# Altium schematic sheet S7CAS-PLEIADES-CARTE-MERE_P07_FPGA_3.SchDoc
size Tabloid; DocumentNumber: 7; SheetNumber: 7; SheetTotal: 16; Sheet_Name: FPGA_3; Size: 11x17
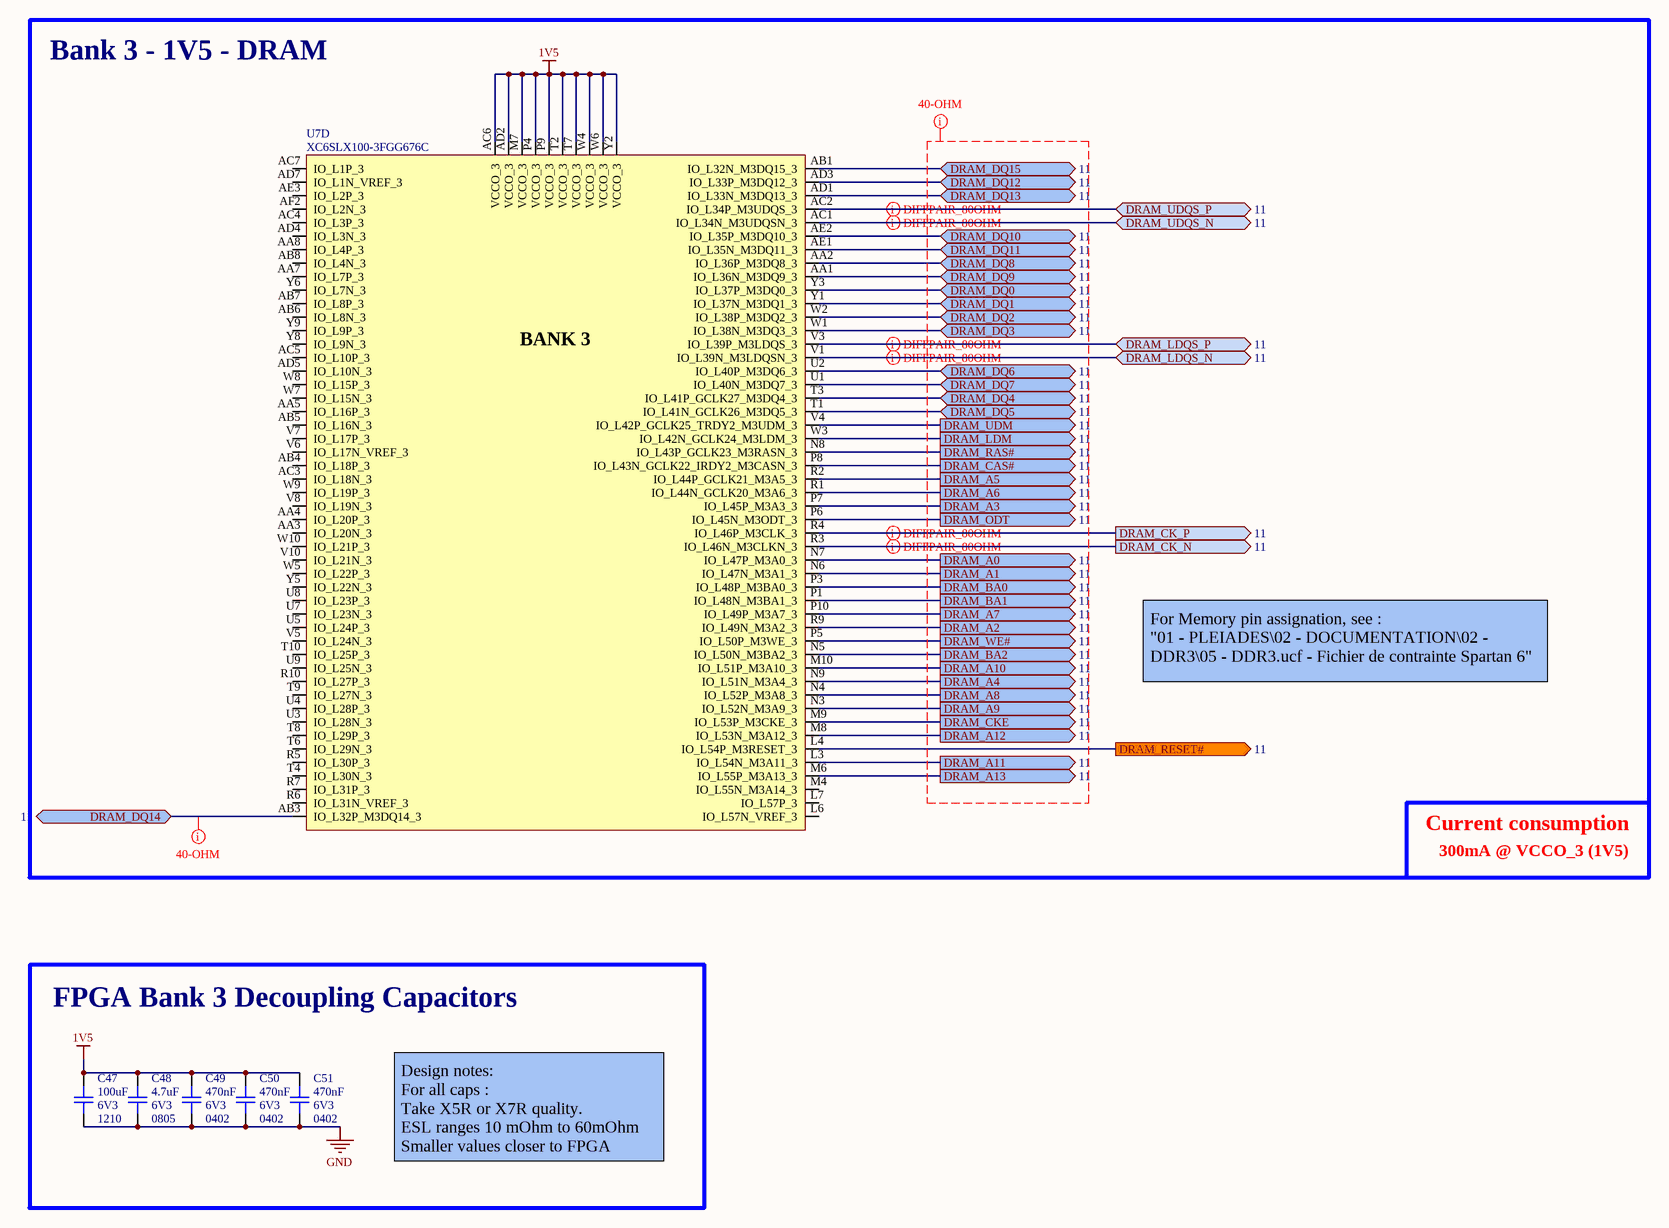
[diagram p0: S7CAS-PLEIADES-CARTE-MERE_P07_FPGA_3.SchDoc]

## Parts
C47  value 100uF  Voltage: 6V3  Package: 1210  [CAP_1210]  (hidden comment: CAP - 1210)
C48  value 4.7uF  Voltage: 6V3  Package: 0805  [CAP_0805]  (hidden comment: CAP - 0805)
C49  value 470nF  Voltage: 6V3  Package: 0402  [CAP_0402]  (hidden comment: CAP - 0402)
C50  value 470nF  Voltage: 6V3  Package: 0402  [CAP_0402]  (hidden comment: CAP - 0402)
C51  value 470nF  Voltage: 6V3  Package: 0402  [CAP_0402]  (hidden comment: CAP - 0402)
U7  XC6SLX100-3FGG676C  [FPGA_XILINX_FGG676]  (part D of 10)

## Blocks framed on the sheet
Bank 3 - 1V5 - DRAM: U7
FPGA Bank 3 Decoupling Capacitors: C47-C51

## Ports
DRAM_A0 (out, see 11), DRAM_A1 (out, see 11), DRAM_A2 (out, see 11), DRAM_A3 (out, see 11), DRAM_A4 (out, see 11), DRAM_A5 (out, see 11), DRAM_A6 (out, see 11), DRAM_A7 (out, see 11), DRAM_A8 (out, see 11), DRAM_A9 (out, see 11), DRAM_A10 (out, see 11), DRAM_A11 (out, see 11), DRAM_A12 (out, see 11), DRAM_A13 (out, see 11), DRAM_BA0 (out, see 11), DRAM_BA1 (out, see 11), DRAM_BA2 (out, see 11), DRAM_CAS# (out, see 11), DRAM_CK_N (out, see 11), DRAM_CK_P (out, see 11), DRAM_CKE (out, see 11), DRAM_DQ0 (bidir, see 11), DRAM_DQ1 (bidir, see 11), DRAM_DQ2 (bidir, see 11), DRAM_DQ3 (bidir, see 11), DRAM_DQ4 (bidir, see 11), DRAM_DQ5 (bidir, see 11), DRAM_DQ6 (bidir, see 11), DRAM_DQ7 (bidir, see 11), DRAM_DQ8 (bidir, see 11), DRAM_DQ9 (bidir, see 11), DRAM_DQ10 (bidir, see 11), DRAM_DQ11 (bidir, see 11), DRAM_DQ12 (bidir, see 11), DRAM_DQ13 (bidir, see 11), DRAM_DQ14 (bidir, see 11), DRAM_DQ15 (bidir, see 11), DRAM_LDM (out, see 11), DRAM_LDQS_N (bidir, see 11), DRAM_LDQS_P (bidir, see 11), DRAM_ODT (out, see 11), DRAM_RAS# (out, see 11), DRAM_RESET# (out, see 11), DRAM_UDM (out, see 11), DRAM_UDQS_N (bidir, see 11), DRAM_UDQS_P (bidir, see 11), DRAM_WE# (out, see 11)

## Nets
1V5: C47.2 C48.2 C49.2 C50.2 C51.2 U7.AC6(VCCO_3) U7.AD2(VCCO_3) U7.M7(VCCO_3) U7.P4(VCCO_3) U7.P9(VCCO_3) U7.T2(VCCO_3) U7.T7(VCCO_3) U7.W4(VCCO_3) U7.W6(VCCO_3) U7.Y2(VCCO_3)
GND: C47.1 C48.1 C49.1 C50.1 C51.1
DRAM_A0: U7.N7(IO_L47P_M3A0_3) ; port DRAM_A0
DRAM_A1: U7.N6(IO_L47N_M3A1_3) ; port DRAM_A1
DRAM_A2: U7.R9(IO_L49N_M3A2_3) ; port DRAM_A2
DRAM_A3: U7.P7(IO_L45P_M3A3_3) ; port DRAM_A3
DRAM_A4: U7.N9(IO_L51N_M3A4_3) ; port DRAM_A4
DRAM_A5: U7.R2(IO_L44P_GCLK21_M3A5_3) ; port DRAM_A5
DRAM_A6: U7.R1(IO_L44N_GCLK20_M3A6_3) ; port DRAM_A6
DRAM_A7: U7.P10(IO_L49P_M3A7_3) ; port DRAM_A7
DRAM_A8: U7.N4(IO_L52P_M3A8_3) ; port DRAM_A8
DRAM_A9: U7.N3(IO_L52N_M3A9_3) ; port DRAM_A9
DRAM_A10: U7.M10(IO_L51P_M3A10_3) ; port DRAM_A10
DRAM_A11: U7.L3(IO_L54N_M3A11_3) ; port DRAM_A11
DRAM_A12: U7.M8(IO_L53N_M3A12_3) ; port DRAM_A12
DRAM_A13: U7.M6(IO_L55P_M3A13_3) ; port DRAM_A13
DRAM_BA0: U7.P3(IO_L48P_M3BA0_3) ; port DRAM_BA0
DRAM_BA1: U7.P1(IO_L48N_M3BA1_3) ; port DRAM_BA1
DRAM_BA2: U7.N5(IO_L50N_M3BA2_3) ; port DRAM_BA2
DRAM_CAS#: U7.P8(IO_L43N_GCLK22_IRDY2_M3CASN_3) ; port DRAM_CAS#
DRAM_CK_N: U7.R3(IO_L46N_M3CLKN_3) ; port DRAM_CK_N
DRAM_CK_P: U7.R4(IO_L46P_M3CLK_3) ; port DRAM_CK_P
DRAM_CKE: U7.M9(IO_L53P_M3CKE_3) ; port DRAM_CKE
DRAM_DQ0: U7.Y3(IO_L37P_M3DQ0_3) ; port DRAM_DQ0
DRAM_DQ1: U7.Y1(IO_L37N_M3DQ1_3) ; port DRAM_DQ1
DRAM_DQ2: U7.W2(IO_L38P_M3DQ2_3) ; port DRAM_DQ2
DRAM_DQ3: U7.W1(IO_L38N_M3DQ3_3) ; port DRAM_DQ3
DRAM_DQ4: U7.T3(IO_L41P_GCLK27_M3DQ4_3) ; port DRAM_DQ4
DRAM_DQ5: U7.T1(IO_L41N_GCLK26_M3DQ5_3) ; port DRAM_DQ5
DRAM_DQ6: U7.U2(IO_L40P_M3DQ6_3) ; port DRAM_DQ6
DRAM_DQ7: U7.U1(IO_L40N_M3DQ7_3) ; port DRAM_DQ7
DRAM_DQ8: U7.AA2(IO_L36P_M3DQ8_3) ; port DRAM_DQ8
DRAM_DQ9: U7.AA1(IO_L36N_M3DQ9_3) ; port DRAM_DQ9
DRAM_DQ10: U7.AE2(IO_L35P_M3DQ10_3) ; port DRAM_DQ10
DRAM_DQ11: U7.AE1(IO_L35N_M3DQ11_3) ; port DRAM_DQ11
DRAM_DQ12: U7.AD3(IO_L33P_M3DQ12_3) ; port DRAM_DQ12
DRAM_DQ13: U7.AD1(IO_L33N_M3DQ13_3) ; port DRAM_DQ13
DRAM_DQ14: U7.AB3(IO_L32P_M3DQ14_3) ; port DRAM_DQ14
DRAM_DQ15: U7.AB1(IO_L32N_M3DQ15_3) ; port DRAM_DQ15
DRAM_LDM: U7.W3(IO_L42N_GCLK24_M3LDM_3) ; port DRAM_LDM
DRAM_LDQS_N: U7.V1(IO_L39N_M3LDQSN_3) ; port DRAM_LDQS_N
DRAM_LDQS_P: U7.V3(IO_L39P_M3LDQS_3) ; port DRAM_LDQS_P
DRAM_ODT: U7.P6(IO_L45N_M3ODT_3) ; port DRAM_ODT
DRAM_RAS#: U7.N8(IO_L43P_GCLK23_M3RASN_3) ; port DRAM_RAS#
DRAM_RESET#: U7.L4(IO_L54P_M3RESET_3) ; port DRAM_RESET#
DRAM_UDM: U7.V4(IO_L42P_GCLK25_TRDY2_M3UDM_3) ; port DRAM_UDM
DRAM_UDQS_N: U7.AC1(IO_L34N_M3UDQSN_3) ; port DRAM_UDQS_N
DRAM_UDQS_P: U7.AC2(IO_L34P_M3UDQS_3) ; port DRAM_UDQS_P
DRAM_WE#: U7.P5(IO_L50P_M3WE_3) ; port DRAM_WE#

Not connected (* = marked no-connect by the designer): U7 AA3(IO_L20N_3) AA4(IO_L20P_3) AA5(IO_L16P_3) AA7(IO_L7P_3) AA8(IO_L4P_3) AB4(IO_L18P_3) AB5(IO_L16N_3) AB6(IO_L8N_3) AB7(IO_L8P_3) AB8(IO_L4N_3) AC3(IO_L18N_3) AC4(IO_L3P_3) AC5(IO_L10P_3) AC7(IO_L1P_3) AD4(IO_L3N_3) AD5(IO_L10N_3) AD7(IO_L1N_VREF_3) AE3(IO_L2P_3) AF2(IO_L2N_3) L6(IO_L57N_VREF_3) L7(IO_L57P_3) M4(IO_L55N_M3A14_3) R5(IO_L30P_3) R6(IO_L31N_VREF_3) R7(IO_L31P_3) R10(IO_L27P_3) T4(IO_L30N_3) T6(IO_L29N_3) T8(IO_L29P_3) T9(IO_L27N_3) T10(IO_L25P_3) U3(IO_L28N_3) U4(IO_L28P_3) U5(IO_L24P_3) U7(IO_L23N_3) U8(IO_L23P_3) U9(IO_L25N_3) V5(IO_L24N_3) V6(IO_L17N_VREF_3) V7(IO_L17P_3) V8(IO_L19N_3) V10(IO_L21N_3) W5(IO_L22P_3) W7(IO_L15N_3) W8(IO_L15P_3) W9(IO_L19P_3) W10(IO_L21P_3) Y5(IO_L22N_3) Y6(IO_L7N_3) Y8(IO_L9N_3) Y9(IO_L9P_3)

## Layout directives
differential pair; differential pair class DIFF_80_OHM: DRAM_CK_N, DRAM_CK_P, DRAM_LDQS_N, DRAM_LDQS_P, DRAM_UDQS_N, DRAM_UDQS_P
net class SE_40OHM: (no net found under the mark), DRAM_DQ14

## Notes on the sheet
- For Memory pin assignation, see :
  "01 - PLEIADES\02 - DOCUMENTATION\02 - DDR3\05 - DDR3.ucf - Fichier de contrainte Spartan 6"
- Current consumption
- 300mA @ VCCO_3 (1V5)
- Design notes:
  For all caps :
  Take X5R or X7R quality.
  ESL ranges 10 mOhm to 60mOhm
  Smaller values closer to FPGA
- Sheet Name
- Project Title
- Global Project
- Size
- Group
- Revision
- Date
- Sheet
- of
- Filename
- Designers
- (in symbol FPGA_XC6SLX100-3FGG676C, part D) BANK 3

## Library data of the parts
C47 = CAP - 1210: Precision: 10%; Current: *; CreatedBy: Jonathan Bouchard; Power: *
C48 = CAP - 0805: Precision: 10%; Current: *; CreatedBy: Jonathan Bouchard; Power: *
C49-C51 = CAP - 0402: Precision: 10%; Current: *; CreatedBy: Jonathan Bouchard; Power: *
U7 = FPGA_XC6SLX100-3FGG676C: FPGA - XILINX SPARTAN 6 480 I/O - BGA-676; Voltage: 1.14 V ~ 1.26 V; Current: *; Power: *; Mfg: Xilinx; Mfg Part Number: XC6SLX100-3FGG676C; HelpURL: https://www.xilinx.com/support/documentation/data_sheets/ds162.pdf; CreatedBy: Jonathan Bouchard; Temperature: 0°C ~ 85°C (TJ); Value: *; Precision: *; Package: BGA-676; Supplier 1: Digikey; Supplier Part Number 1: 122-1760-ND